# Altium schematic sheet [0] COVER PAGE.SchDoc
size 431 x 279 mm; SheetNumber: 1; SheetTotal: 9
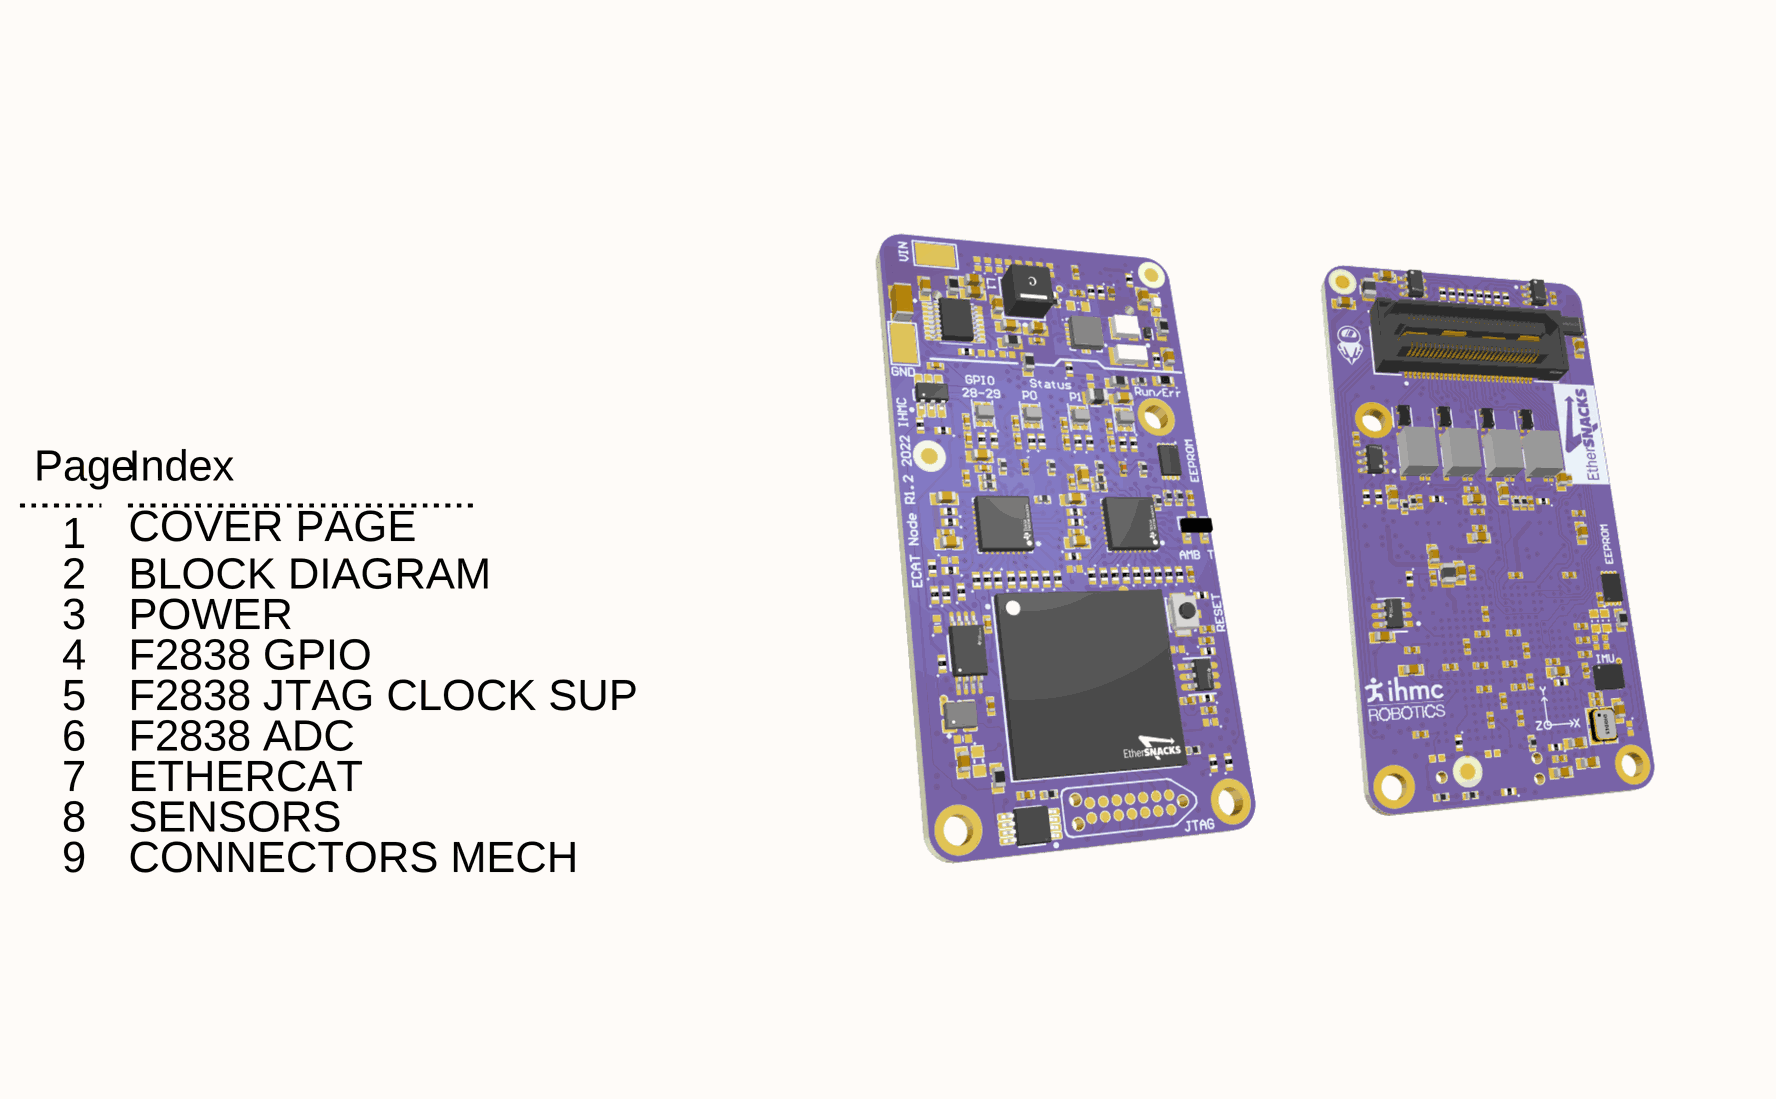
[diagram p0: [0] COVER PAGE.SchDoc]

## Notes on the sheet
- Page
- Index
- 1
- COVER PAGE
- 2
- BLOCK DIAGRAM
- 3
- 4
- POWER
- F2838 GPIO
- 5
- 6
- F2838 JTAG CLOCK SUP
- F2838 ADC
- 7
- 8
- ETHERCAT
- SENSORS
- 9
- CONNECTORS MECH
- REVISION
- DESCRIPTION
- DATE
- PROJECT:
- AUTHOR:
- TITLE:
- FILE NAME:
- CUR REV:
- PCB:
- SHEET:
- DATE:
- OF